# EAGLE design ESP32-TrackerREV2-Corrected-Stencil2 (EAGLE 9.5.2)
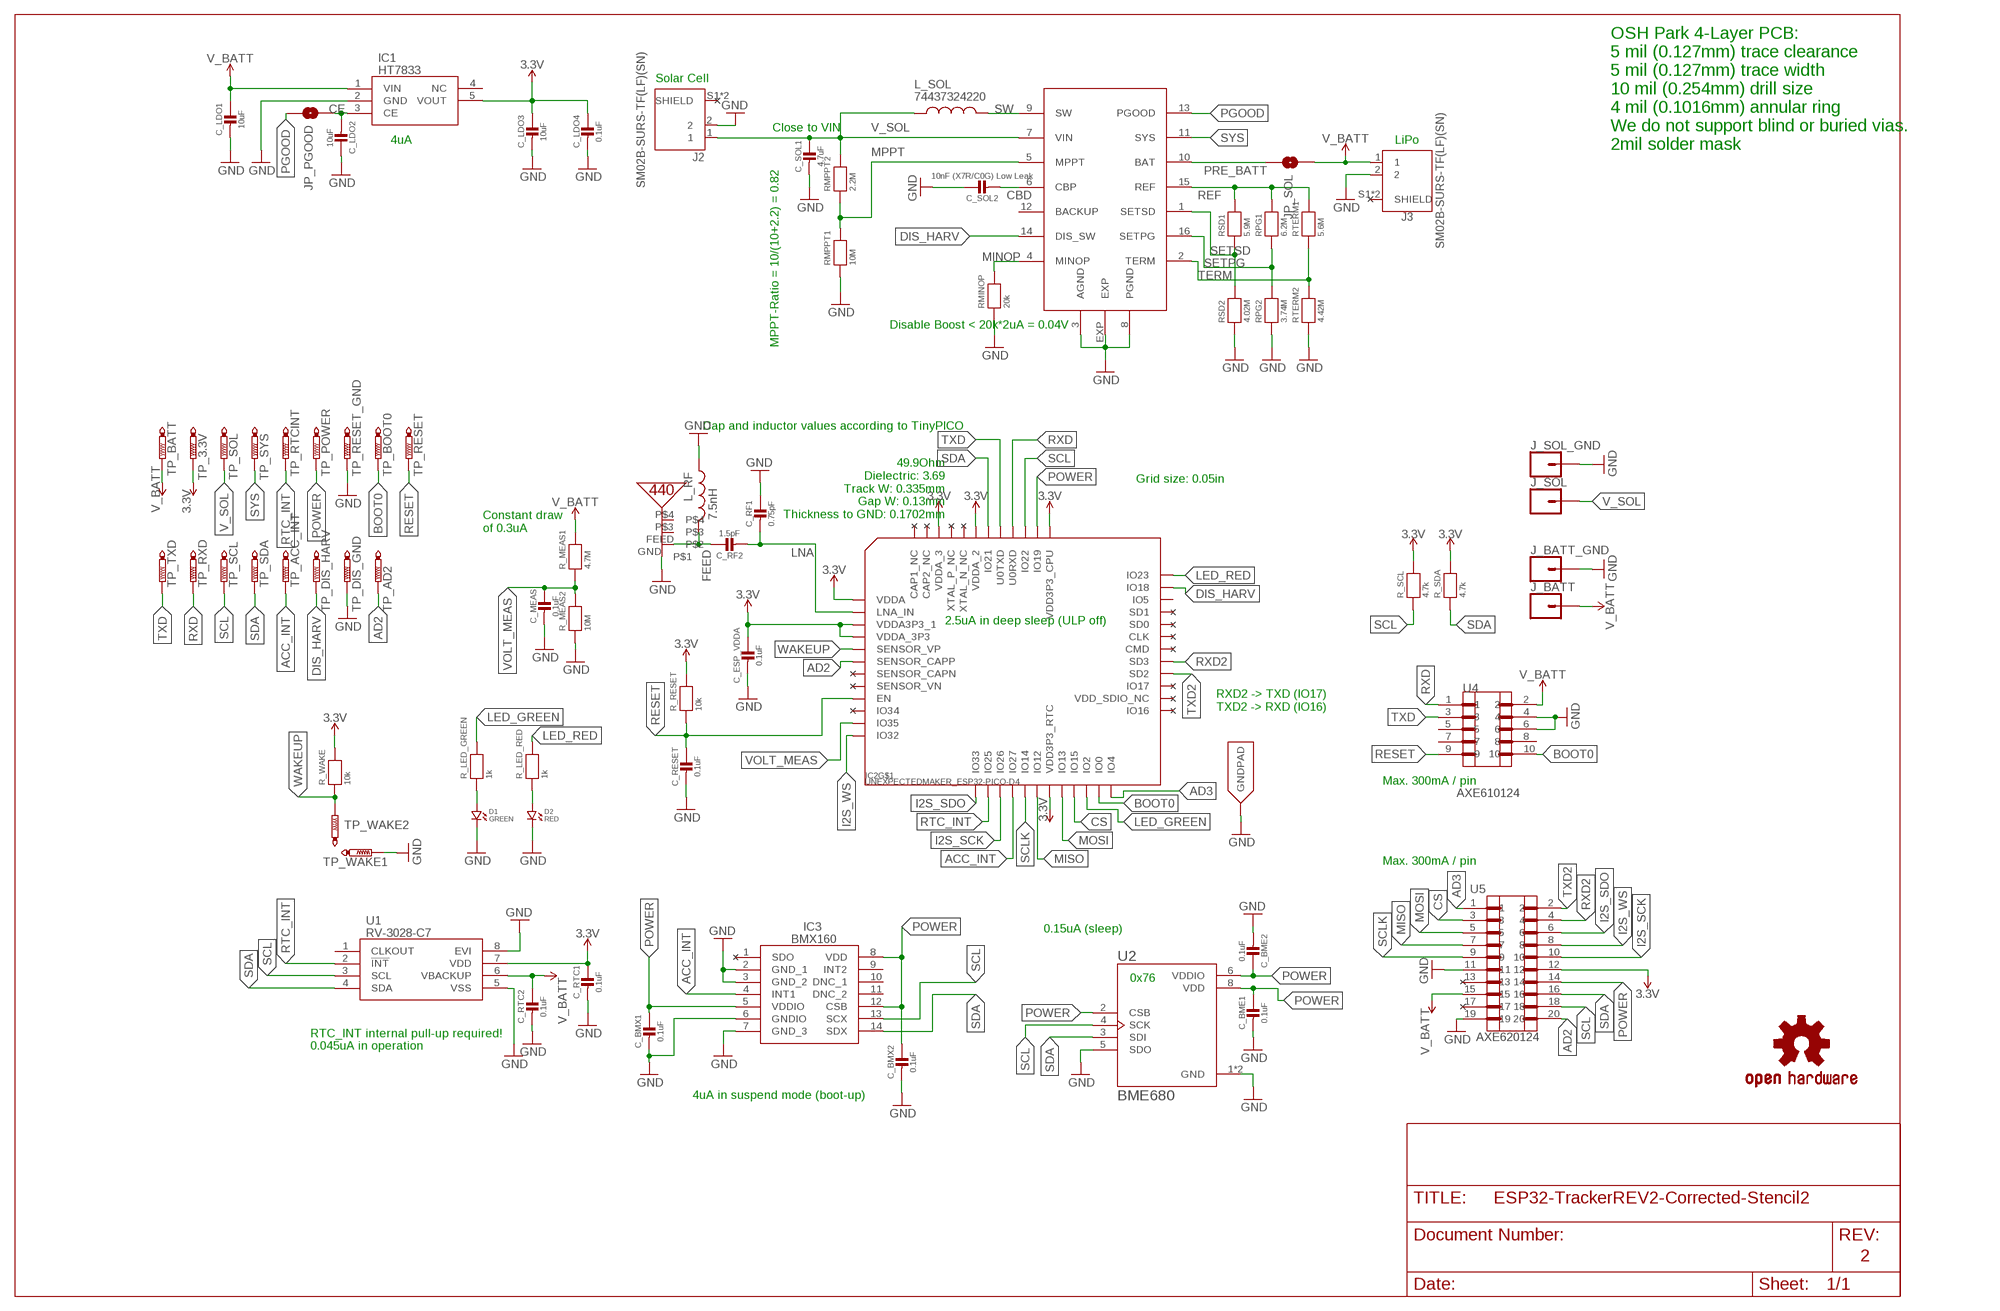
[diagram p0: schematic, sheet 1]

## Parts
C_BME1  0.1uF  MICROBUILDER_CAP_CERAMIC_0402MP  [MICROBUILDER__0402MP]
C_BME2  0.1uF  MICROBUILDER_CAP_CERAMIC_0402MP  [MICROBUILDER__0402MP]
C_BMX1  0.1uF  MICROBUILDER_CAP_CERAMIC_0402MP  [MICROBUILDER__0402MP]
C_BMX2  0.1uF  MICROBUILDER_CAP_CERAMIC_0402MP  [MICROBUILDER__0402MP]
C_ESP_VDDA  0.1uF  MICROBUILDER_CAP_CERAMIC_0402MP  [MICROBUILDER__0402MP]
C_LDO1  10uF  MICROBUILDER_CAP_CERAMIC_0402MP  [MICROBUILDER__0402MP]
C_LDO2  10uF  MICROBUILDER_CAP_CERAMIC_0402MP  [MICROBUILDER__0402MP]
C_LDO3  10uF  MICROBUILDER_CAP_CERAMIC_0402MP  [MICROBUILDER__0402MP]
C_LDO4  0.1uF  MICROBUILDER_CAP_CERAMIC_0402MP  [MICROBUILDER__0402MP]
C_MEAS  0.1uF  MICROBUILDER_CAP_CERAMIC_0402MP  [MICROBUILDER__0402MP]
C_RESET  0.1uF  MICROBUILDER_CAP_CERAMIC_0402MP  [MICROBUILDER__0402MP]
C_RF1  0.75pF  MICROBUILDER_CAP_CERAMIC_0402MP  [MICROBUILDER__0402MP]
C_RF2  1.5pF  MICROBUILDER_CAP_CERAMIC_0402MP  [MICROBUILDER__0402MP]
C_RTC1  0.1uF  MICROBUILDER_CAP_CERAMIC_0402MP  [MICROBUILDER__0402MP]
C_RTC2  0.1uF  MICROBUILDER_CAP_CERAMIC_0402MP  [MICROBUILDER__0402MP]
C_SOL1  4.7uF  MICROBUILDER_CAP_CERAMIC_0402MP  [MICROBUILDER__0402MP]
C_SOL2  10nF (X7R/C0G) Low Leak  MICROBUILDER_CAP_CERAMIC_0402MP  [MICROBUILDER__0402MP]
D1  GREEN  CMONR_STANDARDPARTS_LED.0402  [CMONR_STANDARDPARTS_0402.LED]
D2  RED  CMONR_STANDARDPARTS_LED.0402  [CMONR_STANDARDPARTS_0402.LED]
IC1  HT7833  [SOT95P280X80-5N]
IC2  UNEXPECTEDMAKER_ESP32-PICO-D4  [UNEXPECTEDMAKER_PICO-D4-QFN48]
IC3  BMX160  [PQFN50P300X250X88-14N]
J2  SM02B-SURS-TF(LF)(SN)  [JST_SM02B-SURS-TF(LF)(SN)]
J3  SM02B-SURS-TF(LF)(SN)  [JST_SM02B-SURS-TF(LF)(SN)]
J_BATT  CONN_01PTH_NO_SILK_SMALL  [1X01_SMALL]
J_BATT_GND  CONN_01PTH_NO_SILK_SMALL  [1X01_SMALL]
J_SOL  CONN_01PTH_NO_SILK_SMALL  [1X01_SMALL]
J_SOL_GND  CONN_01PTH_NO_SILK_SMALL  [1X01_SMALL]
JP_PGOOD  JUMPER-SMT_2_NO_NO-SILK  [SMT-JUMPER_2_NO_NO-SILK]
JP_SOL  JUMPER-SMT_2_NO_NO-SILK  [SMT-JUMPER_2_NO_NO-SILK]
L_RF  7.5nH  NORDIC_NRF_INDUCTOR_0402_N  [NORDIC_NRF_RESC0402_N]
L_SOL  74437324220  [IND_74437324220]
LOGO1  OSHW-LOGOS  [OSHW-LOGO-S]
R_LED_GREEN  1k  MICROBUILDER_RESISTOR_0402MP  [MICROBUILDER__0402MP]
R_LED_RED  1k  MICROBUILDER_RESISTOR_0402MP  [MICROBUILDER__0402MP]
R_MEAS1  4.7M  MICROBUILDER_RESISTOR_0402MP  [MICROBUILDER__0402MP]
R_MEAS2  10M  MICROBUILDER_RESISTOR_0402MP  [MICROBUILDER__0402MP]
R_RESET  10k  MICROBUILDER_RESISTOR_0402MP  [MICROBUILDER__0402MP]
R_SCL  4.7k  MICROBUILDER_RESISTOR_0402MP  [MICROBUILDER__0402MP]
R_SDA  4.7k  MICROBUILDER_RESISTOR_0402MP  [MICROBUILDER__0402MP]
R_WAKE  10k  MICROBUILDER_RESISTOR_0402MP  [MICROBUILDER__0402MP]
RMINOP  20k  MICROBUILDER_RESISTOR_0402MP  [MICROBUILDER__0402MP]
RMPPT1  10M  MICROBUILDER_RESISTOR_0402MP  [MICROBUILDER__0402MP]
RMPPT2  2.2M  MICROBUILDER_RESISTOR_0402MP  [MICROBUILDER__0402MP]
RPG1  6.2M  MICROBUILDER_RESISTOR_0402MP  [MICROBUILDER__0402MP]
RPG2  3.74M  MICROBUILDER_RESISTOR_0402MP  [MICROBUILDER__0402MP]
RSD1  5.9M  MICROBUILDER_RESISTOR_0402MP  [MICROBUILDER__0402MP]
RSD2  4.02M  MICROBUILDER_RESISTOR_0402MP  [MICROBUILDER__0402MP]
RTERM1  5.6M  MICROBUILDER_RESISTOR_0402MP  [MICROBUILDER__0402MP]
RTERM2  4.42M  MICROBUILDER_RESISTOR_0402MP  [MICROBUILDER__0402MP]
TP_3.3V  PTR1TP06SQ  [TP06SQ]
TP_ACC_INT  PTR1TP06SQ  [TP06SQ]
TP_AD2  PTR1TP06SQ  [TP06SQ]
TP_BATT  PTR1TP06SQ  [TP06SQ]
TP_BOOT0  PTR1TP06SQ  [TP06SQ]
TP_DIS_GND  PTR1TP06SQ  [TP06SQ]
TP_DIS_HARV  PTR1TP06SQ  [TP06SQ]
TP_POWER  PTR1TP06SQ  [TP06SQ]
TP_RESET  PTR1TP06SQ  [TP06SQ]
TP_RESET_GND  PTR1TP06SQ  [TP06SQ]
TP_RTCINT  PTR1TP06SQ  [TP06SQ]
TP_RXD  PTR1TP06SQ  [TP06SQ]
TP_SCL  PTR1TP06SQ  [TP06SQ]
TP_SDA  PTR1TP06SQ  [TP06SQ]
TP_SOL  PTR1TP06SQ  [TP06SQ]
TP_SYS  PTR1TP06SQ  [TP06SQ]
TP_TXD  PTR1TP06SQ  [TP06SQ]
TP_WAKE1  PTR1TP06SQ  [TP06SQ]
TP_WAKE2  PTR1TP06SQ  [TP06SQ]
U1  RV-3028-C7  [RV3028C7]
U2  BME680  [PSON80P300X300X100-8N]
U3  UNEXPECTEDMAKER_PRO-OB-440  [UNEXPECTEDMAKER_PRO-OB-440]
U4  AXE610124  [AXE610124]
U5  AXE620124  [AXE620124]
U6  ADP5090_LFCSP-16-3X3_ADP5090  [ADP5090_LFCSP-16-3X3_LFCSP-16-3X3]

## Nets
3.3V: C_ESP_VDDA.1 C_LDO3.1 C_LDO4.1 C_RTC1.1 IC1.5(VOUT) IC2.1(VDDA) IC2.3(VDDA3P3_1) IC2.4(VDDA_3P3) IC2.19(VDD3P3_RTC) IC2.37(VDD3P3_CPU) IC2.43(VDDA_2) IC2.46(VDDA_3) R_RESET.2 R_SCL.2 R_SDA.2 R_WAKE.2 TP_3.3V.TP U1.7(VDD) U5.12
ACC_INT: IC2.16(IO27) IC3.4(INT1) TP_ACC_INT.TP
AD2: IC2.6(SENSOR_CAPP) TP_AD2.TP U5.20
AD3: IC2.24(IO4) U5.1
BOOT0: IC2.23(IO0) TP_BOOT0.TP U4.10
CBD: C_SOL2.2 U6.6(CBP)
CE: C_LDO2.2 IC1.3(CE) JP_PGOOD.2
CS: IC2.21(IO15) U5.3
DIS_HARV: IC2.35(IO18) TP_DIS_HARV.TP U6.14(DIS_SW)
FEED: C_RF2.1 L_RF.2 U3.FEED
GND: C_BME1.2 C_BME2.2 C_BMX1.2 C_BMX2.2 C_ESP_VDDA.2 C_LDO1.2 C_LDO2.1 C_LDO3.2 C_LDO4.2 C_MEAS.2 C_RESET.2 C_RF1.1 C_RTC1.2 C_RTC2.2 C_SOL1.2 C_SOL2.1 D1.P$2 D2.P$2 IC1.2(GND) IC2.EXP(GNDPAD) IC3.2(GND_1) IC3.3(GND_2) IC3.6(GNDIO) IC3.7(GND_3) J2.2 J3.2 J_BATT_GND.P$1 J_SOL_GND.P$1 L_RF.1 R_MEAS2.1 RMINOP.1 RMPPT1.1 RPG2.1 RSD2.1 RTERM2.1 TP_DIS_GND.TP TP_RESET_GND.TP TP_WAKE1.TP U1.5(VSS) U1.8(EVI) U2.1(GND) U2.5(SDO) U2.7(GND) U3.GND U4.4 U4.6 U5.11 U5.19 U6.3(AGND) U6.8(PGND) U6.EXP
I2S_SCK: IC2.15(IO26) U5.10
I2S_SDO: IC2.13(IO33) U5.6
I2S_WS: IC2.12(IO32) U5.8
LED_GREEN: IC2.22(IO2) R_LED_GREEN.2
LED_RED: IC2.36(IO23) R_LED_RED.2
LNA: C_RF1.2 C_RF2.2 IC2.2(LNA_IN)
MINOP: RMINOP.2 U6.4(MINOP)
MISO: IC2.18(IO12) U5.7
MOSI: IC2.20(IO13) U5.5
MPPT: RMPPT1.2 RMPPT2.1 U6.5(MPPT)
N$5: D1.P$1 R_LED_GREEN.1
N$6: D2.P$1 R_LED_RED.1
PGOOD: JP_PGOOD.1 U6.13(PGOOD)
POWER: C_BME1.1 C_BME2.1 C_BMX1.1 C_BMX2.1 IC2.38(IO19) IC3.5(VDDIO) IC3.8(VDD) IC3.12(CSB) TP_POWER.TP U2.2(CSB) U2.6(VDDIO) U2.8(VDD) U5.14
PRE_BATT: JP_SOL.1 U6.10(BAT)
REF: RPG1.2 RSD1.2 RTERM1.2 U6.15(REF)
RESET: C_RESET.1 IC2.9(EN) R_RESET.1 TP_RESET.TP U4.9
RTC_INT: IC2.14(IO25) TP_RTCINT.TP U1.2(!INT)
RXD: IC2.40(U0RXD) TP_RXD.TP U4.1
RXD2: IC2.29(SD3) U5.4
SCL: IC2.39(IO22) IC3.13(SCX) R_SCL.1 TP_SCL.TP U1.3(SCL) U2.4(SCK) U5.18
SCLK: IC2.17(IO14) U5.9
SDA: IC2.42(IO21) IC3.14(SDX) R_SDA.1 TP_SDA.TP U1.4(SDA) U2.3(SDI) U5.16
SETPG: RPG1.1 RPG2.2 U6.16(SETPG)
SETSD: RSD1.1 RSD2.2 U6.1(SETSD)
SW: L_SOL.2 U6.9(SW)
SYS: TP_SYS.TP U6.11(SYS)
TERM: RTERM1.1 RTERM2.2 U6.2(TERM)
TXD: IC2.41(U0TXD) TP_TXD.TP U4.3
TXD2: IC2.28(SD2) U5.2
V_BATT: C_LDO1.1 C_RTC2.1 IC1.1(VIN) J3.1 J_BATT.P$1 JP_SOL.2 R_MEAS1.2 TP_BATT.TP U1.6(VBACKUP) U4.2 U5.15
V_SOL: C_SOL1.1 J2.1 J_SOL.P$1 L_SOL.1 RMPPT2.2 TP_SOL.TP U6.7(VIN)
VOLT_MEAS: C_MEAS.1 IC2.11(IO35) R_MEAS1.1 R_MEAS2.2
WAKEUP: IC2.5(SENSOR_VP) R_WAKE.1 TP_WAKE2.TP
Unconnected: IC1.4(NC) IC2.8(SENSOR_VN) IC2.10(IO34) IC2.25(IO16) IC2.26(VDD_SDIO_NC) IC2.27(IO17) IC2.30(CMD) IC2.31(CLK) IC2.32(SD0) IC2.33(SD1) IC2.34(IO5) IC2.44(XTAL_N_NC) IC2.45(XTAL_P_NC) IC2.47(CAP2_NC) IC2.48(CAP1_NC) IC3.1(SDO) IC3.9(INT2) IC3.10(DNC_1) IC3.11(DNC_2) J2.S1(SHIELD) J2.S2(SHIELD) J3.S1(SHIELD) J3.S2(SHIELD) U1.1(CLKOUT) U3.P$3 U3.P$4 U4.5 U4.7 U4.8 U5.13 U5.17 U6.12(BACKUP)

## Notes on the sheet
- Solar Cell
- Close to VIN
- 4uA | LiPo
- OSH Park 4-Layer PCB:
  5 mil (0.127mm) trace clearance
  5 mil (0.127mm) trace width
  10 mil (0.254mm) drill size
  4 mil (0.1016mm) annular ring
  We do not support blind or buried vias.
  2mil solder mask
- Disable Boost < 20k*2uA = 0.04V
- MPPT-Ratio = 10/(10+2.2) = 0.82
- Cap and inductor values according to TinyPICO
- 49.9Ohm
  Dielectric: 3.69
  Track W: 0.335mm
  Gap W: 0.13mm
  Thickness to GND: 0.1702mm
- Grid size: 0.05in
- Constant draw
  of 0.3uA
- 2.5uA in deep sleep (ULP off)
- RXD2 -> TXD (IO17)
  TXD2 -> RXD (IO16)
- Max. 300mA / pin
- Max. 300mA / pin
- 0.15uA (sleep)
- 0x76
- RTC_INT internal pull-up required!
- 0.045uA in operation
- 4uA in suspend mode (boot-up)
- 2

## Power pins joined to a net without a drawn wire
SENSOR_CAPN: IC2.7(SENSOR_CAPN)

## Library data of the parts
C_BME1 C_BME2 C_BMX1 C_BMX2 C_ESP_VDDA C_LDO1-C_LDO4 C_MEAS C_RESET C_RF1 C_RF2 C_RTC1 C_RTC2 C_SOL1 C_SOL2 = TinyPICO:MICROBUILDER_CAP_CERAMIC: Ceramic Capacitors For new designs, use the packages preceded by an '_' character since they are more reliable: The following footprints should be used on most boards: _0402 - Standard footprint for regular board layouts _0603 - Standard footprint for regular board layouts _0805 - Standard footprint for regular board layouts _1206 - Standard footprint for regular board layouts For extremely tight-pitch boards where space is at a premium, the following 'micro-pitch' footprints can be used (smaller pads, no silkscreen outline, etc.): _0402MP - Micro-pitch footprint for very dense/compact boards _0603MP - Micro-pitch footprint for very dense/compact boards _0805MP - Micro-pitch footprint for very dense/compact boards _1206MP - Micro-pitch footprint for very dense/compact boards
D1 D2 = TinyPICO:CMONR_STANDARDPARTS_LED
IC1 = HT7833:HT7833: Low Dropout Regulators(LDO) SOT-23-5 RoHS Source: Datasheet <https://datasheet.lcsc.com/szlcsc/1809291540_Holtek-Semicon-HT7833_C164106.pdf>; DESCRIPTION: Low Dropout Regulators(LDO) SOT-23-5 RoHS; HEIGHT: 0.8mm; MANUFACTURER_NAME: Holtek; MANUFACTURER_PART_NUMBER: HT7833
IC2 = TinyPICOV2:UNEXPECTEDMAKER_ESP32-PICO-D4
IC3 = BMX160_V2:BMX160: IMUs - Inertial Measurement Units 9-axis (9DOF) Absolute Orientation MEMS Sensor Source: Datasheet <http://www.mouser.com/datasheet/2/783/BST-BMX160-DS000-11-1480547.pdf>; DESCRIPTION: IMUs - Inertial Measurement Units 9-axis (9DOF) Absolute Orientation MEMS Sensor; HEIGHT: 0.88mm; MANUFACTURER_NAME: Bosch Sensortec; MANUFACTURER_PART_NUMBER: BMX160; MOUSER_PART_NUMBER: 262-BMX160; MOUSER_PRICE-STOCK: https://www.mouser.com/Search/Refine.aspx?Keyword=262-BMX160
J2 J3 = SM02B-SURS-TF_LF__SN_:SM02B-SURS-TF(LF)(SN): SUR Series 2 Position Single Row 0.8 mm Pitch Side Entry SMT Shrouded Header; DESCRIPTION: Connector Header Surface Mount, Right Angle 2 position 0.031 _0.80mm_; DIGI-KEY_PART_NUMBER: 455-2039-1-ND; DIGI-KEY_PURCHASE_URL: https://www.digikey.com/product-detail/en/jst-sales-america-inc/SM02B-SURS-TF_LF__SN_/455-2039-1-ND/1634927?utm_source=snapeda&utm_medium=aggregator&utm_campaign=symbol; MF: JST Sales; MP: SM02B-SURS-TF_LF__SN_; PACKAGE: None
J_BATT J_BATT_GND J_SOL J_SOL_GND = SparkFun-Connectors:CONN_01: Single connection point. Often used as Generic Header-pin footprint for 0.1 inch spaced/style header connections On any of the 0.1 inch spaced packages, you can populate with these: Break Away Headers - Straight <https://www.sparkfun.com/products/116> (PRT-00116) Break Away Male Headers - Right Angle <https://www.sparkfun.com/products/553> (PRT-00553) Female Headers <https://www.sparkfun.com/products/115> (PRT-00115) Break Away Headers - Machine Pin <https://www.sparkfun.com/products/117> (PRT-00117) Break Away Female Headers - Swiss Machine Pin <https://www.sparkfun.com/products/743> (PRT-00743) This device is also useful as a general connection point to wire up your design to another part of your project. Our various solder wires solder well into these plated through hole pads. Hook-Up Wire - Assortment (Stranded, 22 AWG) <https://www.sparkfun.com/products/11375> (PRT-11375) Hook-Up Wire - Assortment (Solid Core, 22 AWG) <https://www.sparkfun.com/products/11367> (PRT-11367) View the entire wire category on our website here <https://www.sparkfun.com/categories/141> Special notes: SMTSO-256-ET is a "flush mount" nut for a 4-40 screw. We mostly use this on specialty testbeds; it is a nice way to connect hardware to your PCB at an adjustable hieght. Also note, the SNAP packages are for using a snappable style connector. We sell a baggie of snaps and they are also used on two LilyPad designs: Snap Assortment - 30 pack (male and female) <https://www.sparkfun.com/products/11347> (DEV-11347) LilyPad Arduino SimpleSnap <https://www.sparkfun.com/products/10941> (DEV-10941) LilyPad SimpleSnap Protoboard <https://www.sparkfun.com/products/10940> (DEV-10940)
JP_PGOOD JP_SOL = SparkFun-Jumpers-NoCream:JUMPER-SMT_2_NO: Normally open jumper This jumper has two pads in close proximity to each other. Apply solder to close the connection. Round pads are easier to solder for beginners, but are a lot larger. SparkFun Product that uses the round pads: SparkFun EL Sequencer <https://www.sparkfun.com/products/12781>
L_RF = TinyPICO:NORDIC_NRF_INDUCTOR: Generic chip inductor
L_SOL = 74437324220:74437324220: LHMI Inductor 4020 1.0uH 5.0A 27.0mOhm; AVAILABILITY: Unavailable; DESCRIPTION: 22µH Shielded Molded Inductor 1A 500mOhm Max Nonstandard; MF: Wurth Electronics; MP: 74437324220; PACKAGE: Nonstandard Würth Elektronik; PRICE: None
LOGO1 = SparkFun-Aesthetics:OSHW-LOGO: Open-Source Hardware (OSHW) Logo This logo indicates the piece of hardware it is found on incorporates a OSHW license and/or adheres to the definition of open source hardware found here: http://freedomdefined.org/OSHW
R_LED_GREEN R_LED_RED R_MEAS1 R_MEAS2 R_RESET R_SCL R_SDA R_WAKE RMINOP RMPPT1 RMPPT2 RPG1 RPG2 RSD1 RSD2 RTERM1 RTERM2 = TinyPICO:MICROBUILDER_RESISTOR: Resistors 0402 - 0402 Surface Mount Package 22 Ohm 1% 1/16W [Digikey: 311-22.0LRTR-ND] 33 Ohm 5% 1/16W 1.0K 5% 1/16W 1.5K 5% 1/16W 2.0K 1% 1/16W 10.0K 1% 1/16W [Digikey: 311-10.0KLRTR-ND] 10.0K 5% 1/16W [Digikey: RMCF0402JT10K0TR-ND] 12.1K 1% 1/16W [Digikey: 311-22.0LRTR-ND] 100.0K 5% 1/16W 0603 - 0603 Surface Mount Package 0 Ohm 1/10 Watt 1% Resistor 15 Ohm 1/10 Watt 1% Resistor 33 Ohm 1/10 Watt 1% Resistor 49.9 Ohm 1/10 Watt 1% Resistor 100 Ohm 1/10 Watt 1% Resistor 150 Ohm 1/10 Watt 1% Resistor 240 Ohm 1/10 Watt 1% Resistor 390 Ohm 1/10 Watt 1% Resistor 560 Ohm 1/10 Watt 1% Resistor 680 Ohm 1/10 Watt 1% Resistor 750 Ohm 1/10 Watt 1% Resistor 1.0K Ohm 1/10 Watt 1% Resistor 1.5K Ohm 1/10 Watt 1% Resistor 2.0K Ohm 1/10 Watt 1% Resistor 2.2K Ohm 1/10 Watt 1% Resistor 3.3K Ohm 1/10 Watt 1% Resistor 4.7K Ohm 1/10 Watt 1% Resistor 10.0K Ohm 1/10 Watt 1% Resistor 12.0K Ohm 1/10 Watt 1% Resistor 12.1K Ohm 1/10 Watt 1% Resistor 20.0K Ohm 1/10 Watt 1% Resistor 33.0K Ohm 1/10 Watt 1% Resistor 100.0K Ohm 1/10 Watt 1% Resistor 0805 - 0805 Surface Mount Package 0 Ohm 1/8 Watt 1% Resistor 33 Ohm 1/8 Watt 1% Resistor 100 Ohm 1/8 Watt 1% Resistor 150 Ohm 1/8 Watt 1% Resistor 200 Ohm 1/8 Watt 1% Resistor 240 Ohm 1/8 Watt 1% Resistor 330 Ohm 1/8 Watt 1% Resistor 390 Ohm 1/8 Watt 1% Resistor 470 Ohm 1/8 Watt 1% Resistor 1.0K Ohm 1/8 Watt 1% Resistor 1.5K Ohm 1/8 Watt 1% Resistor 2.0K Ohm 1/8 Watt 1% Resistor 4.7K Ohm 1/8 Watt 1% Resistor 5.1K Ohm 1/8 Watt 1% Resistor 5.6K Ohm 1/8 Watt 1% Resistor 10.0K Ohm 1/8 Watt 1% Resistor 22.0K Ohm 1/8 Watt 1% Resistor 33.0K Ohm 1/8 Watt 1% Resistor 100K Ohm 1/8 Watt 1% Resistor 1206 - 1206 Surface Mount Package 2012 - 2010 Surface Mount Package 0.11 Ohm 1/2 Watt 1% Resistor - Digikey: RHM.11UCT-ND
TP_3.3V TP_ACC_INT TP_AD2 TP_BATT TP_BOOT0 TP_DIS_GND TP_DIS_HARV TP_POWER TP_RESET TP_RESET_GND TP_RTCINT TP_RXD TP_SCL TP_SDA TP_SOL TP_SYS TP_TXD TP_WAKE1 TP_WAKE2 = testpad:PTR1: TEST PIN
U1 = RV-3028-C7:RV-3028-C7: Extreme Low Power RTC Module Source: Datasheet <http://www.microcrystal.com/images/_Product-Documentation/02_Oscillator_&_RTC_Modules/01_Datasheet/RV-3028-C7.pdf>; DESCRIPTION: Extreme Low Power RTC Module; HEIGHT: 0mm; MANUFACTURER_NAME: Micro Crystal AG; MANUFACTURER_PART_NUMBER: RV-3028-C7
U2 = BME680:BME680: Integrated Environmental Unit; DESCRIPTION: Gas, Humidity, Pressure, Temperature Sensor I²C, SPI Output; DIGI-KEY_PART_NUMBER: 828-1077-1-ND; DIGI-KEY_PURCHASE_URL: https://www.digikey.com/product-detail/en/bosch-sensortec/BME680/828-1077-1-ND/7401321?utm_source=snapeda&utm_medium=aggregator&utm_campaign=symbol; MF: Bosch Sensortec; MP: BME680; PACKAGE: LGA-8 Bosch Tools
U3 = TinyPICO:UNEXPECTEDMAKER_PRO-OB-440
U4 = PanasonicA4SConnectorsV4_CreamAdjust:AXE610124
U5 = PanasonicA4SConnectorsV4_CreamAdjust:AXE620124
U6 = ADP5090_WithCreamOnPadV3:ADP5090_LFCSP-16-3X3_ADP5090

## Board
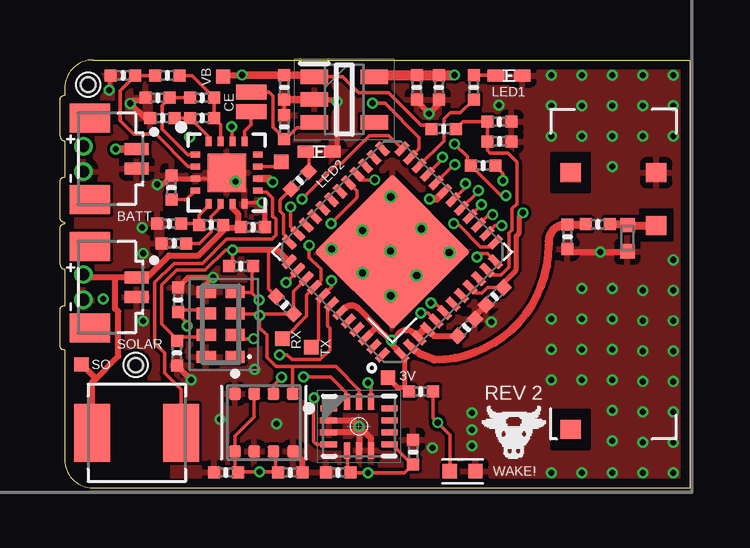
[diagram p1: board, top side]
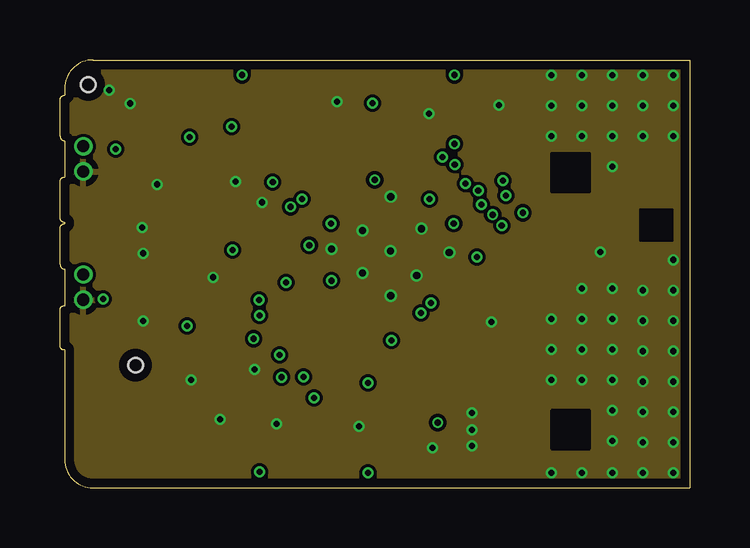
[diagram p2: board, inner layer GND]
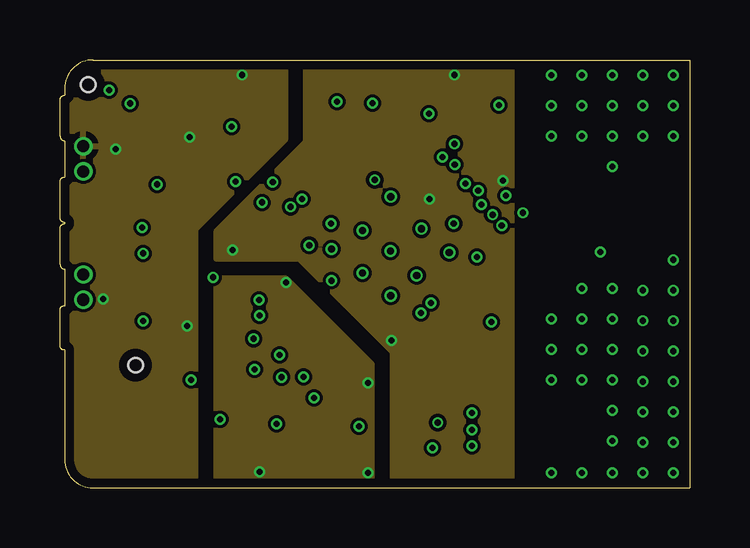
[diagram p3: board, inner layer 3.3V]
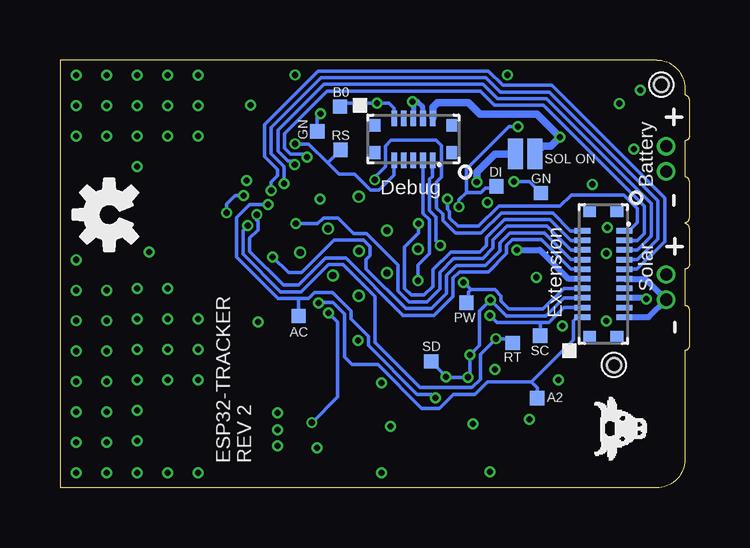
[diagram p4: board, bottom side, seen from below]

Size 26.25 x 17.85 mm. Coordinates in mm from the lower left corner, seen from the top.
Outline: 1.38,0 26.25,0 26.25,17.85 1.38,17.85 arc90 0.2,16.68 0.2,16.38 arc90 0,16.18 0,14.68 arc90 0.2,14.47 0.2,12.97 arc90 0,12.78 0,11.28 arc90 0.2,11.07 0.2,11.03 arc90 0,10.82 0,9.32 arc90 0.2,9.12 0.2,7.6 arc90 0,7.45 0,5.9 arc90 0.2,5.75 0.2,1.18 arc90 1.38,0
Copper layers (1+2*15+16): Top 0.0356mm / dielectric 0.1702mm / GND 0.0178mm / dielectric 47mil / 3.3V 0.0178mm / dielectric 0.1702mm / Bottom 0.0356mm
Design rules "ESP32-TrackerREV2-4LayerOSHPark": minimum track width 5mil, minimum drill 10mil, track to track 5mil, track to pad 5mil, pad to pad 5mil, via to via 5mil, smd to smd 5mil, copper to edge 15mil, drill to drill 6mil, minimum pad ring 4mil, minimum via ring 4mil, stop-mask expansion 0mil, vias tented up to drill 12mil, thermal gap 10mil
Holes 0.6 mm at 3.15,5.12 1.18,16.82

### Footprints (pad centres in the part's own frame; a part is rotated, then mirrored left to right if it is on the bottom)
MICROBUILDER__0402MP = smd 0.5 x 0.5: 1 -0.508,0; 2 0.508,0
CMONR_STANDARDPARTS_0402.LED = smd 0.7 x 0.5: P$1 -0.55,0; P$2 0.55,0
SOT95P280X80-5N = smd 1.15 x 0.6: 1 -1.25,0.95; 2 -1.25,0; 3 -1.25,-0.95; 4 1.25,-0.95; 5 1.25,0.95
UNEXPECTEDMAKER_PICO-D4-QFN48 = smd 0.66 x 0.3: 1 -3.327,2.75; 2 -3.327,2.25; 3 -3.327,1.75; 4 -3.327,1.25; 5 -3.327,0.75; 6 -3.327,0.25; 7 -3.327,-0.25; 8 -3.327,-0.75; 9 -3.327,-1.25; 10 -3.327,-1.75; 11 -3.327,-2.25; 12 -3.327,-2.75; 25 3.327,-2.75; 26 3.327,-2.25; 27 3.327,-1.75; 28 3.327,-1.25; 29 3.327,-0.75; 30 3.327,-0.25; 31 3.327,0.25; 32 3.327,0.75; 33 3.327,1.25; 34 3.327,1.75; 35 3.327,2.25; 36 3.327,2.75 | smd 0.3 x 0.66: 13 -2.75,-3.327; 14 -2.25,-3.327; 15 -1.75,-3.327; 16 -1.25,-3.327; 17 -0.75,-3.327; 18 -0.25,-3.327; 19 0.25,-3.327; 20 0.75,-3.327; 21 1.25,-3.327; 22 1.75,-3.327; 23 2.25,-3.327; 24 2.75,-3.327; 37 2.75,3.327; 38 2.25,3.327; 39 1.75,3.327; 40 1.25,3.327; 41 0.75,3.327; 42 0.25,3.327; 43 -0.25,3.327; 44 -0.75,3.327; 45 -1.25,3.327; 46 -1.75,3.327; 47 -2.25,3.327; 48 -2.75,3.327 | smd 4.572 x 4.572: EXP 0,0
PQFN50P300X250X88-14N = smd 0.675 x 0.25: 1 -1.265,0.75; 2 -1.265,0.25; 3 -1.265,-0.25; 4 -1.265,-0.75; 8 1.26,-0.75; 9 1.26,-0.25; 10 1.26,0.25; 11 1.26,0.75 | smd 0.25 x 0.675: 5 -0.5,-1.015; 6 0,-1.015; 7 0.5,-1.015; 12 0.5,1.01; 13 0,1.01; 14 -0.5,1.01
JST_SM02B-SURS-TF(LF)(SN) = smd 0.5 x 1: 1 -0.4,0; 2 0.4,0 | smd 1.2 x 1.7: S1 -1.7,-1.95; S2 1.7,-1.95
1X01_SMALL = drill 0.508: P$1 0,0
SMT-JUMPER_2_NO_NO-SILK = smd 0.635 x 1.27: 1 -0.406,0; 2 0.406,0
NORDIC_NRF_RESC0402_N = smd 0.6 x 0.6: 1 -0.55,0; 2 0.55,0
IND_74437324220 = smd 1.5 x 2.4: 1 -1.85,0; 2 1.85,0
TP06SQ = smd 0.6 x 0.6: TP 0,0
RV3028C7 = smd 0.5 x 0.8: 1 -1.35,-0.6; 2 -0.45,-0.6; 3 0.45,-0.6; 4 1.35,-0.6; 5 1.35,0.6; 6 0.45,0.6; 7 -0.45,0.6; 8 -1.35,0.6
PSON80P300X300X100-8N = smd 0.5 x 0.5: 1 1.2,1.2; 2 1.2,0.4; 3 1.2,-0.4; 4 1.2,-1.2; 5 -1.2,-1.22; 6 -1.2,-0.4; 7 -1.2,0.4; 8 -1.2,1.2
UNEXPECTEDMAKER_PRO-OB-440 = smd 0.8 x 0.86: FEED 8.9,-4.4; GND 11.1,-4.4; P$3 11.1,-0.83; P$4 0.4,-0.83
AXE610124 = smd 0.23 x 0.65: 1 0.81,-0.88; 2 0.81,0.87; 3 0.41,-0.88; 4 0.41,0.87; 5 0.01,-0.88; 6 0.01,0.87; 7 -0.39,-0.88; 8 -0.39,0.87; 9 -0.79,-0.88; 10 -0.79,0.87 | smd 0.45 x 0.53: DNC1 -1.59,0.57; DNC2 -1.59,-0.569; DNC3 1.607,-0.569; DNC4 1.607,0.57
AXE620124 = smd 0.23 x 0.65: 1 1.8,-0.88; 2 1.8,0.87; 3 1.4,-0.88; 4 1.4,0.87; 5 1,-0.88; 6 1,0.87; 7 0.6,-0.88; 8 0.6,0.87; 9 0.2,-0.88; 10 0.2,0.87; 11 -0.2,-0.88; 12 -0.2,0.87; 13 -0.6,-0.88; 14 -0.6,0.87; 15 -1,-0.88; 16 -1,0.87; 17 -1.4,-0.88; 18 -1.4,0.87; 19 -1.8,-0.88; 20 -1.8,0.87 | smd 0.45 x 0.53: DNC1 -2.6,0.57; DNC2 -2.6,-0.569; DNC3 2.597,-0.569; DNC4 2.597,0.57
ADP5090_LFCSP-16-3X3_LFCSP-16-3X3 = smd 0.4 x 0.25: 1 -1.3,0.75; 2 -1.3,0.25; 3 -1.3,-0.25; 4 -1.3,-0.75; 9 1.3,-0.75; 10 1.3,-0.25; 11 1.3,0.25; 12 1.3,0.75 | smd 0.25 x 0.4: 5 -0.75,-1.3; 6 -0.25,-1.3; 7 0.25,-1.3; 8 0.75,-1.3; 13 0.75,1.3; 14 0.25,1.3; 15 -0.25,1.3; 16 -0.75,1.3 | smd 1.6 x 1.6: EXP 0,0

### Placement (x,y rotation side)
C_BME1  6.92,0.65 180 top
C_BME2  9.6,0.65 0 top
C_BMX1  11.6,0.65 180 top
C_BMX2  14.72,1.5 90 top
C_ESP_VDDA  16.94,6.7 45 top
C_LDO1  9.35,16.7 270 top
C_LDO2  9.35,15.05 270 top
C_LDO3  14.88,16.7 270 top
C_LDO4  15.8,16.7 270 top
C_MEAS  18.32,14.45 0 top
C_RESET  18.13,7.99 225 top
C_RF1  21.16,10.48 90 top
C_RF2  22.43,11 180 top
C_RTC1  4.88,5.62 270 top
C_RTC2  4.92,7.85 90 top
C_SOL1  8.05,10.88 0 top
C_SOL2  4.75,10.2 0 top
D1  18.72,17.2 0 top
D2  10.8,14.03 0 top
IC1  11.85,16.2 0 top
IC2  13.86,9.85 135 top
IC3  12.47,2.58 0 top
J2  3.2,8.38 270 top
J3  3.2,13.72 270 top
J_BATT  0.97,14.25 90 top
J_BATT_GND  0.97,13.2 90 top
J_SOL  0.97,8.9 90 top
J_SOL_GND  0.97,7.85 90 top
JP_PGOOD  7.98,16.1 90 top
JP_SOL  6.85,13.93 0 bottom
L_RF  23.66,10.42 90 top
L_SOL  3.2,2.3 0 top
LOGO1  24.2,11.4 90 bottom
R_LED_GREEN  17.25,16.7 270 top
R_LED_RED  10,12.82 225 top
R_MEAS1  16,14.97 180 top
R_MEAS2  18.32,15.28 180 top
R_RESET  17.64,13.44 0 top
R_SCL  9.38,7.62 135 top
R_SDA  7.55,9.25 180 top
R_WAKE  15.05,4.03 180 top
RMINOP  4.65,12.53 270 top
RMPPT1  4.55,11.03 0 top
RMPPT2  6.3,10.97 0 top
RPG1  5.92,15.43 0 top
RPG2  4.28,15.43 0 top
RSD1  5.92,16.27 0 top
RSD2  4.08,16.27 0 top
RTERM1  4.48,17.2 0 top
RTERM2  2.62,17.2 0 top
TP_3.3V  13.67,4.6 0 top
TP_ACC_INT  16.3,7.17 0 bottom
TP_AD2  6.35,3.75 0 bottom
TP_BATT  6.8,17.15 0 top
TP_BOOT0  14.57,15.9 0 bottom
TP_DIS_GND  6.2,12.3 0 bottom
TP_DIS_HARV  8.05,12.57 0 bottom
TP_POWER  9.3,7.72 0 bottom
TP_RESET  14.55,14.1 0 bottom
TP_RESET_GND  15.52,14.88 0 bottom
TP_RTCINT  7.38,6.05 0 bottom
TP_RXD  9.27,6.22 0 top
TP_SCL  6.23,6.35 0 bottom
TP_SDA  10.77,5.28 0 bottom
TP_SOL  0.9,5.15 0 top
TP_SYS  9.22,13.6 0 top
TP_TXD  10.47,5.88 0 top
TP_WAKE1  17.32,0.7 0 top
TP_WAKE2  16.25,0.7 0 top
U1  6.7,6.83 90 top
U2  8.5,2.73 90 top
U3  20.46,2.05 90 top
U4  11.52,14.55 0 bottom
U5  3.6,8.93 90 bottom
U6  6.95,13.15 0 top

### Tracks (layer width: path | path; a pad name or v marks a point on that pad's centre or on a via)
3.3V  (via drill 0.25)
  Top 0.152: U1.7 6.03,6.3 5.04,6.3 C_RTC1.1 4.83,6.18 4.83,6.26 4.25,6.84 4.25,8.47 4.87,9.09 6.06,9.09 6.9,9.93 v7.2,9.93 7.2,9.41 R_SDA.2 | v18.47,12.82 18.47,13.12 R_RESET.2 | R_SCL.2 8.7,8.3 8.7,9.93 | 14.37,4.2 R_WAKE.2
  Top 0.203: R_WAKE.2 14.37,4.19 14.37,5.44 IC2.1 | 14.37,4.2 14.07,4.2 TP_3.3V.TP
  Top 0.254: IC2.4 15.6,6.34 C_ESP_VDDA.1 | IC2.1 14.02,5.79 14.02,5.8 13.82,6 v13.82,6.15 | v13.82,6.15 14.12,6.45 arc-90 14.78,6.45 IC2.3 | v13.82,6.15 13.77,6.15 13.2,6.72 | 13.2,6.72 12.42,7.5 arc90 11.86,7.5 IC2.43 | IC2.37 9.07,9.93 8.7,9.93 v7.2,9.93 | IC2.46 12.74,6.27 13.2,6.72
  Top 0.305: IC2.4 15.17,6.61 14.97,6.41 IC2.3 | v15.4,12.05 15.71,12.05 IC2.19 | IC1.5 13.16,17.21 | C_LDO4.1 15.82,17.23
  Top 0.406: 13.16,17.21 C_LDO3.1 C_LDO4.1 | 15.82,17.23 v16.45,17.23
  Bottom 0.254: U5.12 5.05,8.72 6.25,9.93 v7.2,9.93
  pour 3.3V: 10.24,17.98 10.24,14.42 6.51,10.69 6.51,9.56 9.97,9.56 13.86,5.67 13.86,-0.14 18.85,-0.14 18.85,17.98
ACC_INT  (via drill 0.25)
  Top 0.152: IC3.4 10.7,1.82 10.57,1.95 10.57,3.73 v10.6,3.76 | IC2.16 17.09,11.33 v17.57,11.82
  Bottom 0.152: v10.6,3.76 10.75,3.91 11.36,3.91 13.39,5.94 13.39,6.33 14.12,7.05 14.12,7.38 14.89,8.15 15.64,8.15 15.89,7.9 16.35,7.9 | v17.57,11.82 17.58,11.82 18.35,11.82 18.9,11.28 18.9,9.63 17.16,7.9 16.35,7.9 | TP_ACC_INT.TP 16.3,7.85 16.35,7.9
AD2  (via drill 0.25)
  Top 0.152: IC2.6 15.63,7.72 v15.46,7.72
  Bottom 0.152: v15.46,7.72 15.24,7.72 15.23,7.73 14.87,7.73 14.4,7.26 14.4,5.47 14.07,5.15 12.99,5.15 11.17,3.32 10.42,3.32 9.84,3.91 8.95,3.91 8.43,4.42 6.6,4.42 | U5.20 4.7,7.12 4.85,6.97 4.85,6.17 6.6,4.42 | TP_AD2.TP 6.35,4.17 6.6,4.42
AD3  (via drill 0.25)
  Top 0.152: IC2.24 13.71,14.7 12.91,14.7 11.76,13.55 11.6,13.55 v10.1,12.05
  Bottom 0.152: U5.1 2.53,10.72 2.18,11.07 2.18,11.65 2.75,12.22 4.92,12.22 5.4,11.75 7.96,11.75 8.8,10.91 9.66,10.91 10.01,11.26 10.01,11.53 10.1,11.62 v10.1,12.05
BOOT0  (via drill 0.25)
  Top 0.152: IC2.23 14.97,14.15 14.97,14.62 13.55,16.05 v13.02,16.05
  Bottom 0.152: U4.10 12.31,15.84 12.52,16.05 v13.02,16.05 14.43,16.05 TP_BOOT0.TP
CBD
  Top 0.152: C_SOL2.2 5.83,10.2 6.31,10.68 6.31,11.31 6.7,11.7 U6.6
CE
  Top 0.152: IC1.3 10.38,15.03 9.88,15.03 9.47,14.62 9.42,14.62 C_LDO2.2 9.35,14.57 8.88,15.04 8.88,16.35 8.72,16.51 JP_PGOOD.2
CS  (via drill 0.25)
  Top 0.152: IC2.21 15.95,13.71 v15.95,13.8
  Bottom 0.152: v15.95,13.8 16.06,13.92 16.63,13.92 16.88,14.17 16.88,14.78 15.11,16.55 8.72,16.55 8.13,15.96 6.08,15.96 1.9,11.77 1.9,10.6 2.18,10.32 U5.3
DIS_HARV  (via drill 0.25)
  Top 0.152: v7.15,15.07 7.17,15.05 7.17,14.47 U6.14 | IC2.35 9.61,10.91 v9.61,11.72
  Bottom 0.152: v9.61,11.72 9.61,12.03 9.31,12.32 | v7.15,15.07 7.53,15.07 9.31,13.29 9.31,12.32 | TP_DIS_HARV.TP 8.12,12.5 8.51,12.5 8.69,12.32 9.31,12.32
FEED
  Top 0.305: 23.63,11 L_RF.2 23.68,10.95
  Top 0.335: C_RF2.1 23.63,11 | 23.68,10.95 U3.FEED
GND  (via drill 0.25, 0.3)
  Top 0.152: C_ESP_VDDA.2 17.3,7.17 | C_LDO1.2 C_LDO2.1 | U6.3 6.7,12.9 U6.EXP | 7.33,12.76 6.94,12.76 | U6.8 7.76,11.91 v8.43,11.91 | RTERM2.1 2.07,17.15 v2.07,16.59 v2.06,16.59
  Top 0.2: U6.3 4.78,12.9 RMINOP.1 4.28,12.66 v4.06,12.66
  Top 0.203: U1.5 6.1,8.5 v6.38,8.79 6.19,8.79 6.19,8.78 5.35,8.78 C_RTC2.2 | IC1.2 11.48,16.2 v11.56,16.12 11.56,14.23 D2.P$2 | C_SOL1.2 8.56,11.79 v8.43,11.91
  Top 0.254: C_RF1.1 21.29,9.85 v22.52,9.85 23.64,9.85 L_RF.1 | 17.3,7.17 C_RESET.2 | RSD2.1 3.44,16.15 3.05,16.15 v2.94,16.04 3.55,15.43 RPG2.1 | C_LDO3.2 14.88,16.13 v15.38,15.62 15.8,16.03 C_LDO4.2 | C_RTC1.2 4.88,5.1 v5.46,4.51 | IC3.2 12.21,2.83 v12.46,2.58 | v12.46,2.58 12.21,2.33 IC3.3 | IC3.6 12.48,2.55 v12.46,2.58 | IC3.7 12.97,2.06 v12.46,2.58 | C_BME2.2 10.11,1.14 U2.5
  Top 0.305: C_LDO1.2 IC1.2
  Bottom 0.152: v15.38,15.62 15.52,15.48 TP_RESET_GND.TP | TP_DIS_GND.TP 6.67,12.78 v7.33,12.78
  Bottom 0.203: U4.4 11.11,15.9 11.33,16.12 v11.56,16.12 11.51,16.07 U4.6
  Bottom 0.254: U5.11 1.85,8.72 J_SOL_GND.P$1 1.7,7.12 U5.19
  other vias: 20.49,0.62 21.76,0.62 23.03,0.62 24.3,0.62 25.57,0.62 23.03,1.97 24.3,1.89 25.57,1.89 23.03,3.24 24.3,3.16 25.57,3.16 23.03,4.51 24.3,4.43 25.57,4.43 21.76,4.51 20.49,4.51 13.78,9.88 15.08,10.81 16.23,9.82 14.87,8.85 13.79,8.02 12.61,8.97 11.33,9.96 12.61,10.73 13.79,12.14 23.03,5.78 24.3,5.7 25.57,5.7 21.76,5.78 20.49,5.78 23.03,7.05 24.3,6.97 25.57,6.97 21.76,7.05 20.49,7.05 23.03,8.32 24.3,8.24 25.57,8.24 21.76,8.32 25.57,9.51 23.03,13.4 20.49,14.67 21.76,14.67 23.03,14.67 24.3,14.67 25.57,14.67 20.49,15.94 21.76,15.94 23.03,15.94 24.3,15.94 25.57,15.94 20.49,17.21 21.76,17.21 23.03,17.21 24.3,17.21 25.57,17.21 18.31,15.97 17.19,1.75 17.19,2.42 17.19,3.12 15.54,1.67 9.04,2.67 3.44,10.86 3.46,9.79 3.46,6.96 6.69,2.86 8.11,4.94 17.99,6.93
  cutout Top: 22.09,13.95 20.5,13.95 20.5,12.36 22.09,12.36
  cutout GND: 25.53,11.61 24.21,11.61 24.21,10.31 25.53,10.31
  cutout GND: 22.09,3.23 20.5,3.23 20.5,1.64 22.09,1.64
  cutout Top: 22.09,3.23 20.5,3.23 20.5,1.64 22.09,1.64
  cutout Top: 25.53,11.61 24.21,11.61 24.21,10.31 25.53,10.31
  cutout GND: 22.09,13.95 20.5,13.95 20.5,12.36 22.09,12.36
  pour Top (isolate 0.13): 0.07,17.98 26.3,17.98 26.3,-0.12 0.07,-0.12
  pour GND: 0.07,17.98 26.3,17.98 26.3,-0.12 0.07,-0.12
  cutout Top: 1.88,4.4 1.88,0.07 4.5,0.07 4.5,4.4
I2S_SCK  (via drill 0.25)
  Top 0.152: IC2.15 17.88,11.39 v18.04,11.39
  Bottom 0.152: v18.04,11.39 18.04,11.18 17.99,11.12 17.99,10.77 18.34,10.41 18.34,9.86 16.93,8.46 16.31,8.46 15.18,9.59 14.33,9.59 11.94,7.2 10.65,7.2 9.86,7.99 9.86,8.75 9.6,9.01 8.39,9.01 7.63,9.77 7.63,10.1 7.38,10.36 6.17,10.36 4.94,9.12 U5.10
I2S_SDO  (via drill 0.25)
  Top 0.152: IC2.13 18.15,10.24 17.97,10.06 17.53,10.06 16.57,11.02 v16.42,11.02
  Bottom 0.152: v16.42,11.02 15.51,11.02 15.26,11.27 14.66,11.27 14.02,10.62 13.48,10.62 12.16,9.3 12.16,8.78 12.16,8.21 11.71,7.76 10.95,7.76 10.42,8.29 10.42,8.98 9.83,9.57 8.62,9.57 8.19,10 8.19,10.34 7.61,10.92 5.94,10.92 4.95,9.93 U5.6
I2S_WS  (via drill 0.25)
  Top 0.152: v17.39,9.64 17.52,9.78 17.81,9.78 IC2.12
  Bottom 0.152: v17.39,9.64 16.73,8.98 16.18,8.98 14.82,10.34 13.59,10.34 13.32,10.07 13.32,9.7 13.48,9.54 13.48,9.14 11.82,7.48 10.77,7.48 10.14,8.11 10.14,8.87 9.72,9.29 8.51,9.29 7.91,9.88 7.91,10.22 7.5,10.64 6.06,10.64 4.94,9.53 U5.8
LED_GREEN
  Top 0.152: IC2.22 16,14.46 16,15.38 16.27,15.65 16.71,15.65 R_LED_GREEN.2
LED_RED
  Top 0.152: IC2.36 9.56,10.36 9.33,10.59 9.33,11.39 9.17,11.55 9.17,12 R_LED_RED.2
LNA
  Top 0.152: IC2.2 14.64,5.9
  Top 0.305: 21.91,10.99 C_RF2.2 | C_RF1.2 21.08,10.99 21.06,10.97
  Top 0.335: 21.06,10.97 arc90 20.38,10.29 20.38,10.13 arc-90 15.6,5.35 15.01,5.59 14.77,5.77 14.64,5.9 | C_RF1.2 21.91,10.99
MINOP
  Top 0.152: RMINOP.2 5.27,12.02 U6.4
MISO  (via drill 0.25)
  Top 0.152: IC2.18 16.9,12.54 v16.9,12.69
  Bottom 0.152: v16.9,12.69 16.9,13.4 17.44,13.94 17.44,15.04 15.36,17.11 8.49,17.11 7.9,16.51 5.85,16.51 1.32,11.98 1.32,10.39 2.18,9.53 U5.7
MOSI  (via drill 0.25)
  Top 0.152: IC2.20 16.44,13.49 v16.46,13.49
  Bottom 0.152: v16.46,13.49 16.61,13.64 16.75,13.64 17.16,14.05 17.16,14.92 15.25,16.83 8.61,16.83 8.01,16.23 5.97,16.23 1.6,11.87 1.6,10.51 2.18,9.93 U5.5
MPPT
  Top 0.152: RMPPT1.2 5.74,11.03 RMPPT2.1 5.79,11.37 6.15,11.73 6.15,11.8 U6.5
N$5
  Top 0.152: R_LED_GREEN.1 D1.P$1
N$6
  Top 0.152: R_LED_RED.1 10.38,13.2 10.38,13.9 D2.P$1
PGOOD
  Top 0.152: U6.13 7.7,14.88 7.98,15.15 JP_PGOOD.1
POWER  (via drill 0.25)
  Top 0.152: U2.6 8.99,1.43 8.99,0.75 C_BME2.1 9.07,0.68 v8.32,0.68 7.43,0.68 C_BME1.1 7.3,0.78 U2.8 7.3,2.17 8.1,2.98 U2.2 | IC3.5 11.98,0.78 C_BMX1.1 12.13,0.62 v12.85,0.62 14.36,0.62 C_BMX2.1 14.68,0.99 13.85,1.82 IC3.8 | IC2.38 9.91,9.06 v9.42,8.57 | v12.85,4.38 12.97,4.25 IC3.12
  Bottom 0.152: 9.12,8.27 v9.42,8.57 | 9.12,8.27 8.12,8.27 7.87,8.02 7.87,7.8 7.53,7.46 6.11,7.46 5.24,8.32 U5.14 | TP_POWER.TP 9.22,7.8 9.22,8.16 9.12,8.27
  pour 3.3V: 13.01,-0.12 13.01,5.16 9.43,8.73 6.5,8.73 6.5,-0.12
PRE_BATT  (via drill 0.25)
  Top 0.305: U6.10 8.72,12.9 v8.87,12.75
  Bottom 0.305: v8.87,12.75 8.87,13.18 8.12,13.93 JP_SOL.1
REF
  Top 0.152: U6.15 6.7,15.16 RPG1.2 RSD1.2 5.51,17.2 RTERM1.2
RESET  (via drill 0.25)
  Top 0.152: IC2.9 17.34,8.12 17.6,8.12 17.83,8.35 C_RESET.1 | v18.59,12.19 18.38,12.19 R_RESET.1 16.98,13.6 16.98,13.82 v16.45,14.35
  Top 0.203: v19.3,11.47 19.15,11.33 19.15,10.64 19.03,10.51 19.03,9.1 18.48,8.55 C_RESET.1
  Bottom 0.152: v16.45,14.35 15.89,14.35 15.08,13.54 | 15.08,13.54 14.62,13.09 13.97,13.09 13.3,12.42 12.95,12.42 12.31,13.05 U4.9 | v19.3,11.47 19.3,11.84 18.94,12.19 v18.59,12.19 | TP_RESET.TP 15.08,13.57 15.08,13.54
RTC_INT  (via drill 0.25)
  Top 0.152: v8.07,6.22 7.45,6.22 U1.2 | IC2.14 18.14,10.94 v18.42,10.94
  Bottom 0.152: v18.42,10.94 18.62,10.75 18.62,9.75 17.05,8.18 16.19,8.18 15.06,9.31 14.44,9.31 13.11,7.98 13.11,6.06 11.24,4.19 9.07,4.19 8.72,4.54 8.72,5.58 v8.07,6.22 7.55,6.22 TP_RTCINT.TP
RXD  (via drill 0.25)
  Top 0.152: v10.39,10.12 10.39,9.62 10.89,9.12 10.89,8.65 IC2.40 10.29,8.05 10.29,7.18 9.33,6.22 TP_RXD.TP
  Bottom 0.152: v10.39,10.12 10.57,10.29 10.57,11.3 10.84,11.57 10.84,12.88 10.71,13 U4.1
RXD2  (via drill 0.25)
  Top 0.152: v11.3,11.03 12.38,12.1 12.38,12.38 IC2.29
  Bottom 0.152: v11.3,11.03 11.3,10.63 11.88,10.05 11.88,8.32 11.59,8.04 11.07,8.04 10.69,8.41 10.69,9.1 9.95,9.85 8.74,9.85 8.47,10.12 8.47,10.45 7.73,11.2 5.82,11.2 4.95,10.32 U5.4
SCL  (via drill 0.25)
  Top 0.152: 9.7,5.08 U2.4 | IC3.13 12.47,4.1 11.5,5.08 9.7,5.08 | 9.7,5.08 9,5.08 8.62,5.45 8.62,6.38 8.32,6.67 v8.32,7.2 8.26,7.27 | 8.26,7.27 7.31,7.27 U1.3 | IC2.39 9.73,8.2 R_SCL.1 8.26,7.27
  Bottom 0.152: U5.18 5.25,7.53 5.88,6.9 6.23,6.9 | 6.23,6.9 8.02,6.9 v8.32,7.2 | TP_SCL.TP 6.23,6.9
SCLK  (via drill 0.25)
  Top 0.152: IC2.17 17.44,12.37 v17.44,12.4
  Bottom 0.152: v17.44,12.4 17.44,12.76 17.18,13.02 17.18,13.28 17.72,13.82 17.72,15.15 15.48,17.39 8.38,17.39 7.78,16.79 5.74,16.79 1.04,12.1 1.04,10.27 2.19,9.12 U5.9
SDA  (via drill 0.25)
  Top 0.152: R_SDA.1 8.01,9.2 8.01,8.15 | 8.01,8.15 8.01,8.13 v8.3,7.84 | U1.4 7.33,8.15 8.01,8.15 | U2.3 8.9,4.28 v9.24,4.62 | IC3.14 11.92,3.63 11.92,3.99 11.28,4.64 v10.15,4.64 | IC2.42 11.16,7.5 11.16,6.76 11.25,6.66 11.25,5.77 10.84,5.35 9.67,5.35 9.47,5.55 v9.15,5.55
  Bottom 0.152: U5.16 5.25,7.92 5.99,7.18 7.64,7.18 v8.3,7.84 v8.3,7.83 8.76,7.38 8.76,5.94 v9.15,5.55 9.15,4.71 v9.24,4.62 10.14,4.62 v10.15,4.64 10.15,4.65 TP_SDA.TP
SETPG
  Top 0.152: RPG2.2 RPG1.1 6.2,14.64 U6.16
SETSD
  Top 0.152: RSD1.1 RSD2.2 4.26,15.95 4.26,14.97 5.33,13.9 U6.1
SW
  Top 0.152: L_SOL.2 5.05,4.11 4.36,4.8 4.36,5.62 3.95,6.03 3.95,8.57 4.75,9.37 5.94,9.37 6.95,10.38 8.84,10.38 9.01,10.54 9.01,11.21 8.89,11.33 8.86,11.33 8.86,11.73 8.87,11.73 8.87,12.09 8.61,12.34 8.31,12.34 U6.9
SYS
  Top 0.152: U6.11 9.02,13.4 TP_SYS.TP
TERM
  Top 0.152: RTERM1.1 RTERM2.2 2.5,16.57 2.5,15.32 3.08,14.75 4,14.75 5.35,13.4 U6.2
TXD  (via drill 0.25)
  Top 0.152: v11.32,8.64 11.32,8.37 IC2.41 10.77,7.83 10.77,6.17 TP_TXD.TP
  Bottom 0.152: v11.32,8.64 11.32,9.3 10.85,9.78 10.85,11.19 11.11,11.45 U4.3
TXD2  (via drill 0.25)
  Top 0.152: IC2.28 12.62,12.85 v13.12,12.85
  Bottom 0.152: v13.12,12.85 13.12,12.97 12.69,13.41 12.69,14.25 12.44,14.5 10.57,14.5 10.35,14.28 10.35,12.97 10.56,12.76 10.56,11.68 10.29,11.42 10.29,11.15 9.77,10.62 8.69,10.62 7.84,11.47 5.71,11.47 4.96,10.72 U5.2
V_BATT  (via drill 0.25)
  Top 0.152: U1.6 5.96,7.42 5,7.42 C_RTC2.1 4.92,7.25 5.3,6.88 v5.3,6.75 | IC1.1 11.77,17.15 12.45,16.48 13.69,16.48 15.04,15.12 15.34,15.12 R_MEAS1.2 | TP_BATT.TP 6.88,17.23
  Top 0.254: 6.88,17.23 v7.6,17.23
  Top 0.305: IC1.1 10.55,17.21 C_LDO1.1 9.33,17.23 v7.6,17.23 | J3.1 v2.33,14.12
  Bottom 0.152: U4.2 10.7,15.44
  Bottom 0.254: v1.8,7.88 1.85,7.92 U5.15
  Bottom 0.305: JP_SOL.2 6.12,14.25 5.78,14.25 v5.4,14.62 6.37,15.6 8.75,15.6 9.22,16.07 10.5,16.07 10.7,15.88 10.7,15.44
  pour 3.3V: 9.4,17.98 0.07,17.98 0.07,-0.12 5.65,-0.12 5.65,10.8 9.4,14.55
V_SOL
  Top 0.254: U6.7 7.2,11.67 7.42,11.45 7.42,11 C_SOL1.1 7.52,10.85 6.93,10.85 RMPPT2.2 6.81,10.72 5.79,9.7 4.55,9.7 3.62,8.78 J2.1 2.3,8.78 | 2.3,8.78 1.1,8.78 J_SOL.P$1 | L_SOL.1 1.35,4.42 1.44,4.51 | 2.3,8.78 2.3,7.48 2.43,7.36 2.43,5.5 1.44,4.51 | TP_SOL.TP 1.44,4.61 1.44,4.51
VOLT_MEAS
  Top 0.152: R_MEAS1.1 16.81,15.28 R_MEAS2.2 C_MEAS.1 17.82,14.08 17.93,13.97 18.68,13.97 19.05,13.6 19.05,11.85 18.85,11.65 18.85,10.77 18.72,10.64 18.72,9.22 18.39,8.89 18,8.89 IC2.11
WAKEUP  (via drill 0.25)
  Top 0.152: TP_WAKE2.TP 16.25,2.23 v15.75,2.73 15.56,2.92 R_WAKE.1 | IC2.5 15.34,7.3 v15.05,7.3
  Bottom 0.152: v15.05,7.3 14.67,6.93 14.67,3.8 v15.75,2.73

### Text on the board
tNames: VB | LED1 | CE | LED2 | BATT | SOLAR | RX | SO | TX | 3V | REV 2 | WAKE!
bNames: B0 | GN | SOL ON | RS | Battery | GN | DI | Debug | Solar | Extension | PW | SC | SD | AC | RT | A2 | REV 2 | ESP32-TRACKER
tDocu: Housing 22 x 35mm